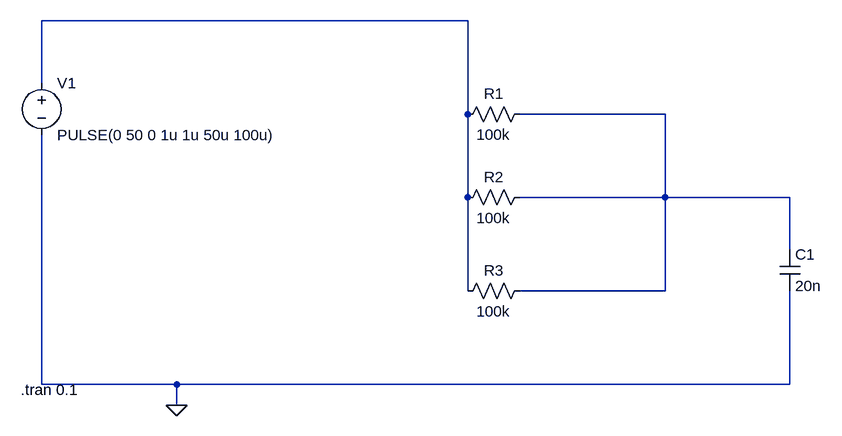
[diagram p0: schematic Draft1.asc]
Draft1.asc, the LTspice schematic file:
Version 4
SHEET 1 880 680
WIRE 80 -64 -576 -64
WIRE -576 32 -576 -64
WIRE 80 80 80 -64
WIRE 384 80 160 80
WIRE 80 208 80 80
WIRE 384 208 384 80
WIRE 384 208 160 208
WIRE 576 208 384 208
WIRE 576 288 576 208
WIRE 80 352 80 208
WIRE 384 352 384 208
WIRE 384 352 160 352
WIRE -576 496 -576 112
WIRE -368 496 -576 496
WIRE 576 496 576 352
WIRE 576 496 -368 496
WIRE -368 528 -368 496
FLAG -368 528 0
SYMBOL res 176 64 R90
WINDOW 0 0 56 VBottom 2
WINDOW 3 32 56 VTop 2
SYMATTR InstName R1
SYMATTR Value 100k
SYMBOL res 176 192 R90
WINDOW 0 0 56 VBottom 2
WINDOW 3 32 56 VTop 2
SYMATTR InstName R2
SYMATTR Value 100k
SYMBOL res 176 336 R90
WINDOW 0 0 56 VBottom 2
WINDOW 3 32 56 VTop 2
SYMATTR InstName R3
SYMATTR Value 100k
SYMBOL cap 560 288 R0
SYMATTR InstName C1
SYMATTR Value 20n
SYMBOL voltage -576 16 R0
WINDOW 123 0 0 Left 0
WINDOW 39 0 0 Left 0
SYMATTR InstName V1
SYMATTR Value PULSE(0 50 0 1u 1u 50u 100u)
TEXT -608 504 Left 2 !.tran 0.1

The netlist it stands for:
* Draft1.asc
R1 N002 N001 100k
R2 N002 N001 100k
R3 N002 N001 100k
C1 N002 0 20n
V1 N001 0 PULSE(0 50 0 1u 1u 50u 100u)
.tran 0.1
.backanno
.end